# Altium project IPMC_TestBoard.PrjPcb
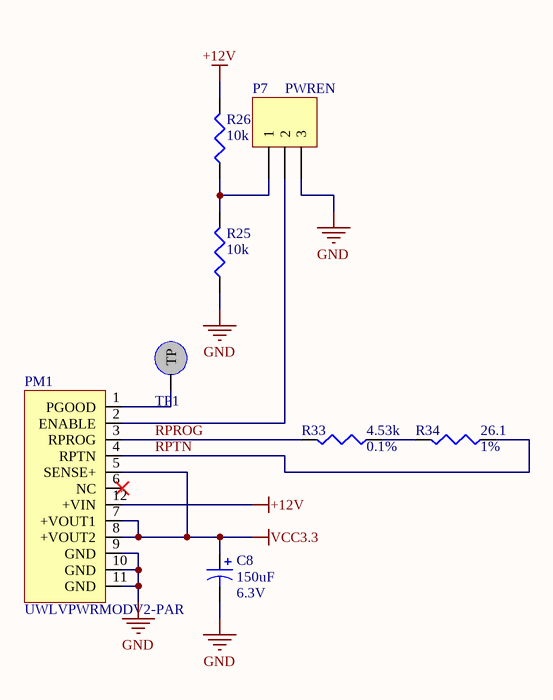
[diagram p0: IPMC_TestBoard.SchDoc]
Title: ZYNQ-IPMC Test Board; Revision: revA1; Company: Univ. Wisconsin-Madison; Author: Vicente, M.; Address2: USA; Address1: Madison, WI 53706
5 sheets, 87 parts. Net scope: global (net labels, ports and power ports of the same name join across sheets).
Board file: IPMC_TestBoard_PCB.PcbDoc
Sheets:
  IPMC_TestBoard.SchDoc
  MMC_Interface.SchDoc
  IPMC_UnderTesting.SchDoc
  IPMC_Control.SchDoc
  UART.SchDoc

## Sheet IPMC_TestBoard.SchDoc: ZYNQ-IPMC Test Board
size A3; Author: Marcelo Vicente; Organization: Univ. of Wisconsin-Madison; Address1: Madison, WI 53706; DocumentNumber: 1; Revision: revA1; SheetNumber: 1; SheetTotal: 5

### Parts
C8  value 150uF  Rating: 6.3V  [VISH-293D-7343-31_V]  (hidden comment: ?)
P7  PWREN  [HEADER1X3]
PM1  UWLVPWRMODV2-PAR  [UWLVPWRMODV2]
R25  value 10k  [R0402_IPC_H]  (hidden comment: ?)
R26  value 10k  [R0402_IPC_H]  (hidden comment: ?)
R33  value 4.53k  Tolerance: 0.1%  [R0402]  (hidden comment: ?)
R34  value 26.1  Tolerance: 1%  [R0402]  (hidden comment: ?)
TP1  TP  [TP]  (value not drawn)

### Nets
+12V: PM1.12(+VIN) R26.2
GND: C8.2 P7.3 PM1.9(GND) PM1.10(GND) PM1.11(GND) R25.1
VCC3.3: C8.1 PM1.5(SENSE+) PM1.7(+VOUT1) PM1.8(+VOUT2)
RPROG: PM1.3(RPROG) R33.2
RPTN: PM1.4(RPTN) R34.1
NetP7_1: P7.1 R25.2 R26.1
NetP7_2: P7.2 PM1.2(ENABLE)
NetPM1_1: PM1.1(PGOOD) TP1.1(TP)
NetR33_1: R33.1 R34.2

Not connected (* = marked no-connect by the designer): PM1 6(NC)*

### Notes on the sheet
- Description
- Title
- Size:
- Date:
- A3
- Number:
- Time:
- Revision:
- Sheet
- of
- File:
- Author:

### Library data of the parts
C8 = Cap Pol3: Polarized Capacitor (Surface Mount); Mfg. Part No.: A700X157M006ATE015; INVKEY: CP7343-150uF-6.3V-ESR15-20%; Mfgr: Kemet
P7 = Header 3: Header, 3-Pin; INVKEY: ?; Mfg. Part No.: ?; Mfgr: ?
PM1 = UWLVPWRMODV2-PAR: UW Low-voltage Power Module V2; Mfgr: University of Wisconsin; Note: Refurbish from oRSCs; INVKEY: ?; Mfg. Part No.: UWLVPWRMODV2
R25 R26 = Res: Resistor; Mfg. Part No.: ERJ-2GEJ103X; Tolerance: 5%; INVKEY: RS0402-10K-1/10W-5%; Mfgr: Panasonic-ECG
R33 = Res: Resistor; Mfg. Part No.: ERA-2AEB4531X; INVKEY: RS0402-4K53-1/16W-PREC; Mfgr: Panasonic-ECG
R34 = Res: Resistor; Mfg. Part No.: ERJ-2RKF26R1X; INVKEY: RS0402-26R1-1/10W-1%; Mfgr: Panasonic-ECG
TP1 = TP: Test Point; INVKEY: NA; Note: Not a part; Mfg. Part No.: NA; Mfgr: NA

## Sheet MMC_Interface.SchDoc: ZYNQ-IPMC Test Board
size A3; Author: Marcelo Vicente; Organization: Univ. of Wisconsin-Madison; Address1: Madison, WI 53706; DocumentNumber: 2; Revision: revA1; SheetNumber: 2; SheetTotal: 5
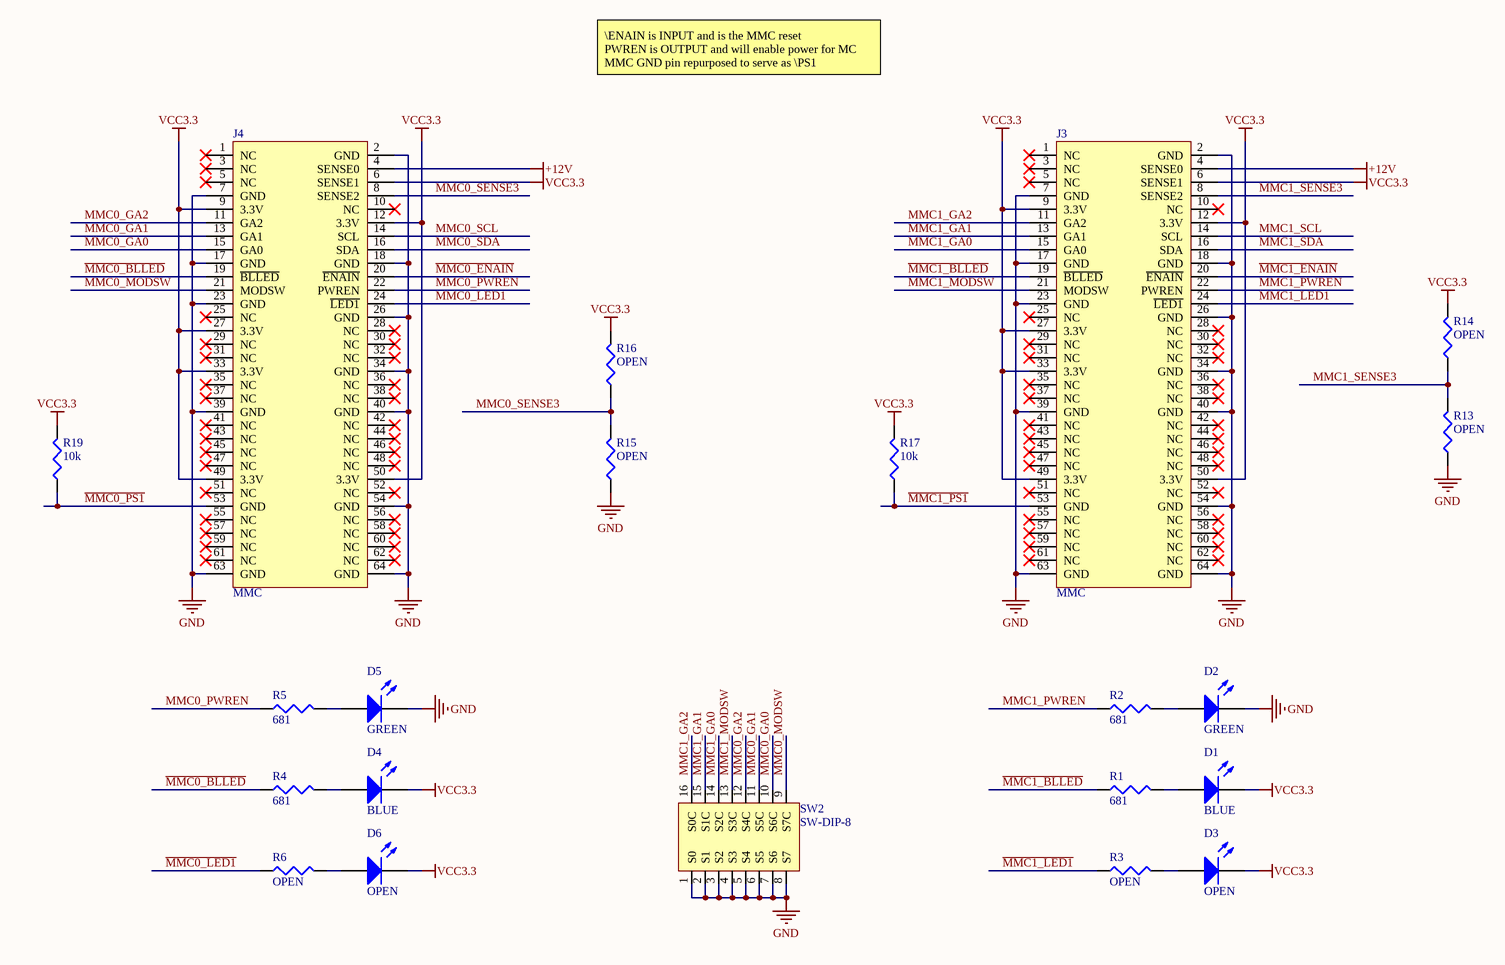
[diagram p1: MMC_Interface.SchDoc]

### Parts
D1  BLUE  [LED0603_M]
D2  GREEN  [LED0603_M]
D3  OPEN  [LED0603_M]
D4  BLUE  [LED0603_M]
D5  GREEN  [LED0603_M]
D6  OPEN  [LED0603_M]
J3  MMC  [5120527-1]
J4  MMC  [5120527-1]
R1  value 681  [R0603]  (hidden comment: ?)
R2  value 681  [R0603]  (hidden comment: ?)
R3  value OPEN  [R0402_IPC_H]  (hidden comment: ?)
R4  value 681  [R0603]  (hidden comment: ?)
R5  value 681  [R0603]  (hidden comment: ?)
R6  value OPEN  [R0402_IPC_H]  (hidden comment: ?)
R13  value OPEN  [R0402_IPC_H]  (hidden comment: ?)
R14  value OPEN  [R0402_IPC_H]  (hidden comment: ?)
R15  value OPEN  [R0402_IPC_H]  (hidden comment: ?)
R16  value OPEN  [R0402_IPC_H]  (hidden comment: ?)
R17  value 10k  [R0402_IPC_H]  (hidden comment: ?)
R19  value 10k  [R0402_IPC_H]  (hidden comment: ?)
SW2  SW-DIP-8  [TDA08H0]

### Nets
+12V: J3.4(SENSE0) J4.4(SENSE0)
GND: D2.2(K) D5.2(K) J3.2(GND) J3.7(GND) J3.17(GND) J3.18(GND) J3.23(GND) J3.26(GND) J3.34(GND) J3.39(GND) J3.40(GND) J3.54(GND) J3.63(GND) J3.64(GND) J4.2(GND) J4.7(GND) J4.17(GND) J4.18(GND) J4.23(GND) J4.26(GND) J4.34(GND) J4.39(GND) J4.40(GND) J4.54(GND) J4.63(GND) J4.64(GND) R13.1 R15.1 SW2.1(S0) SW2.2(S1) SW2.3(S2) SW2.4(S3) SW2.5(S4) SW2.6(S5) SW2.7(S6) SW2.8(S7)
VCC3.3: D1.2(K) D3.2(K) D4.2(K) D6.2(K) J3.6(SENSE1) J3.9(3.3V) J3.12(3.3V) J3.27(3.3V) J3.33(3.3V) J3.49(3.3V) J3.50(3.3V) J4.6(SENSE1) J4.9(3.3V) J4.12(3.3V) J4.27(3.3V) J4.33(3.3V) J4.49(3.3V) J4.50(3.3V) R14.2 R16.2 R17.2 R19.2
~{MMC0_BLLED}: J4.19(~{BLLED}) R4.1
~{MMC0_ENAIN}: J4.20(~{ENAIN})
~{MMC0_LED1}: J4.24(~{LED1}) R6.1
~{MMC0_PS1}: J4.53(GND) R19.1
~{MMC1_BLLED}: J3.19(~{BLLED}) R1.1
~{MMC1_ENAIN}: J3.20(~{ENAIN})
~{MMC1_LED1}: J3.24(~{LED1}) R3.1
~{MMC1_PS1}: J3.53(GND) R17.1
MMC0_GA0: J4.15(GA0) SW2.10(S6C)
MMC0_GA1: J4.13(GA1) SW2.11(S5C)
MMC0_GA2: J4.11(GA2) SW2.12(S4C)
MMC0_MODSW: J4.21(MODSW) SW2.9(S7C)
MMC0_PWREN: J4.22(PWREN) R5.1
MMC0_SCL: J4.14(SCL)
MMC0_SDA: J4.16(SDA)
MMC0_SENSE3: J4.8(SENSE2) R15.2 R16.1
MMC1_GA0: J3.15(GA0) SW2.14(S2C)
MMC1_GA1: J3.13(GA1) SW2.15(S1C)
MMC1_GA2: J3.11(GA2) SW2.16(S0C)
MMC1_MODSW: J3.21(MODSW) SW2.13(S3C)
MMC1_PWREN: J3.22(PWREN) R2.1
MMC1_SCL: J3.14(SCL)
MMC1_SDA: J3.16(SDA)
MMC1_SENSE3: J3.8(SENSE2) R13.2 R14.1
NetD1_1: D1.1(A) R1.2
NetD2_1: D2.1(A) R2.2
NetD3_1: D3.1(A) R3.2
NetD4_1: D4.1(A) R4.2
NetD5_1: D5.1(A) R5.2
NetD6_1: D6.1(A) R6.2

Not connected (* = marked no-connect by the designer): J3 1(NC)* 3(NC)* 5(NC)* 10(NC)* 25(NC)* 28(NC)* 29(NC)* 30(NC)* 31(NC)* 32(NC)* 35(NC)* 36(NC)* 37(NC)* 38(NC)* 41(NC)* 42(NC)* 43(NC)* 44(NC)* 45(NC)* 46(NC)* 47(NC)* 48(NC)* 51(NC)* 52(NC)* 55(NC)* 56(NC)* 57(NC)* 58(NC)* 59(NC)* 60(NC)* 61(NC)* 62(NC)*; J4 1(NC)* 3(NC)* 5(NC)* 10(NC)* 25(NC)* 28(NC)* 29(NC)* 30(NC)* 31(NC)* 32(NC)* 35(NC)* 36(NC)* 37(NC)* 38(NC)* 41(NC)* 42(NC)* 43(NC)* 44(NC)* 45(NC)* 46(NC)* 47(NC)* 48(NC)* 51(NC)* 52(NC)* 55(NC)* 56(NC)* 57(NC)* 58(NC)* 59(NC)* 60(NC)* 61(NC)* 62(NC)*

### Notes on the sheet
- \ENAIN is INPUT and is the MMC reset
  PWREN is OUTPUT and will enable power for MC
  MMC GND pin repurposed to serve as \PS1
- Description
- Title
- Size:
- Date:
- A3
- Number:
- Time:
- Revision:
- Sheet
- of
- File:
- Author:

### Library data of the parts
D1 D4 = LED: Light Emitting Diode; Mfg. Part No.: LTST-S270TBKT; INVKEY: LED-BL-RA-0603; Mfgr: Lite-On; Value: BLUE
D2 D5 = LED: Light Emitting Diode; Mfg. Part No.: LTST-S270KGKT; INVKEY: LED-GRN-RA-UB-0603; Mfgr: Lite-On; Value: GREEN
D3 D6 = LED: Light Emitting Diode; Mfg. Part No.: NA; Note: Do not assemble; Value: OPEN; INVKEY: ?; Mfgr: NA
J3 J4 = MMC: TE 5120527-1; INVKEY: CO-PMC64-120527-1; Mfgr: TE Connectivity; Mfg. Part No.: 5120527-1
R1 R2 R4 R5 = Res: Resistor; Mfg. Part No.: RC0603FR-07681RL; Tolerance: 1%; INVKEY: RS0603-681R-1/10W-1%; Mfgr: Yageo
R3 R6 R13-R16 = Res: Resistor; Mfg. Part No.: NA; Tolerance: 1%; INVKEY: RS0402-OPEN-1/10W; Note: Do not assemble; Mfgr: NA
R17 R19 = Res: as R25 on sheet IPMC_TestBoard
SW2 = SW-DIP-8: C&K TDA08H0SB1R; Mfg. Part No.: TDA08HOSB1; INVKEY: SW-DIP-8X-SMD; Mfgr: C&K

## Sheet IPMC_UnderTesting.SchDoc: ZYNQ-IPMC Test Board
size A3; Author: Marcelo Vicente; Organization: Univ. of Wisconsin-Madison; Address1: Madison, WI 53706; DocumentNumber: 3; Revision: revA1; SheetNumber: 3; SheetTotal: 5
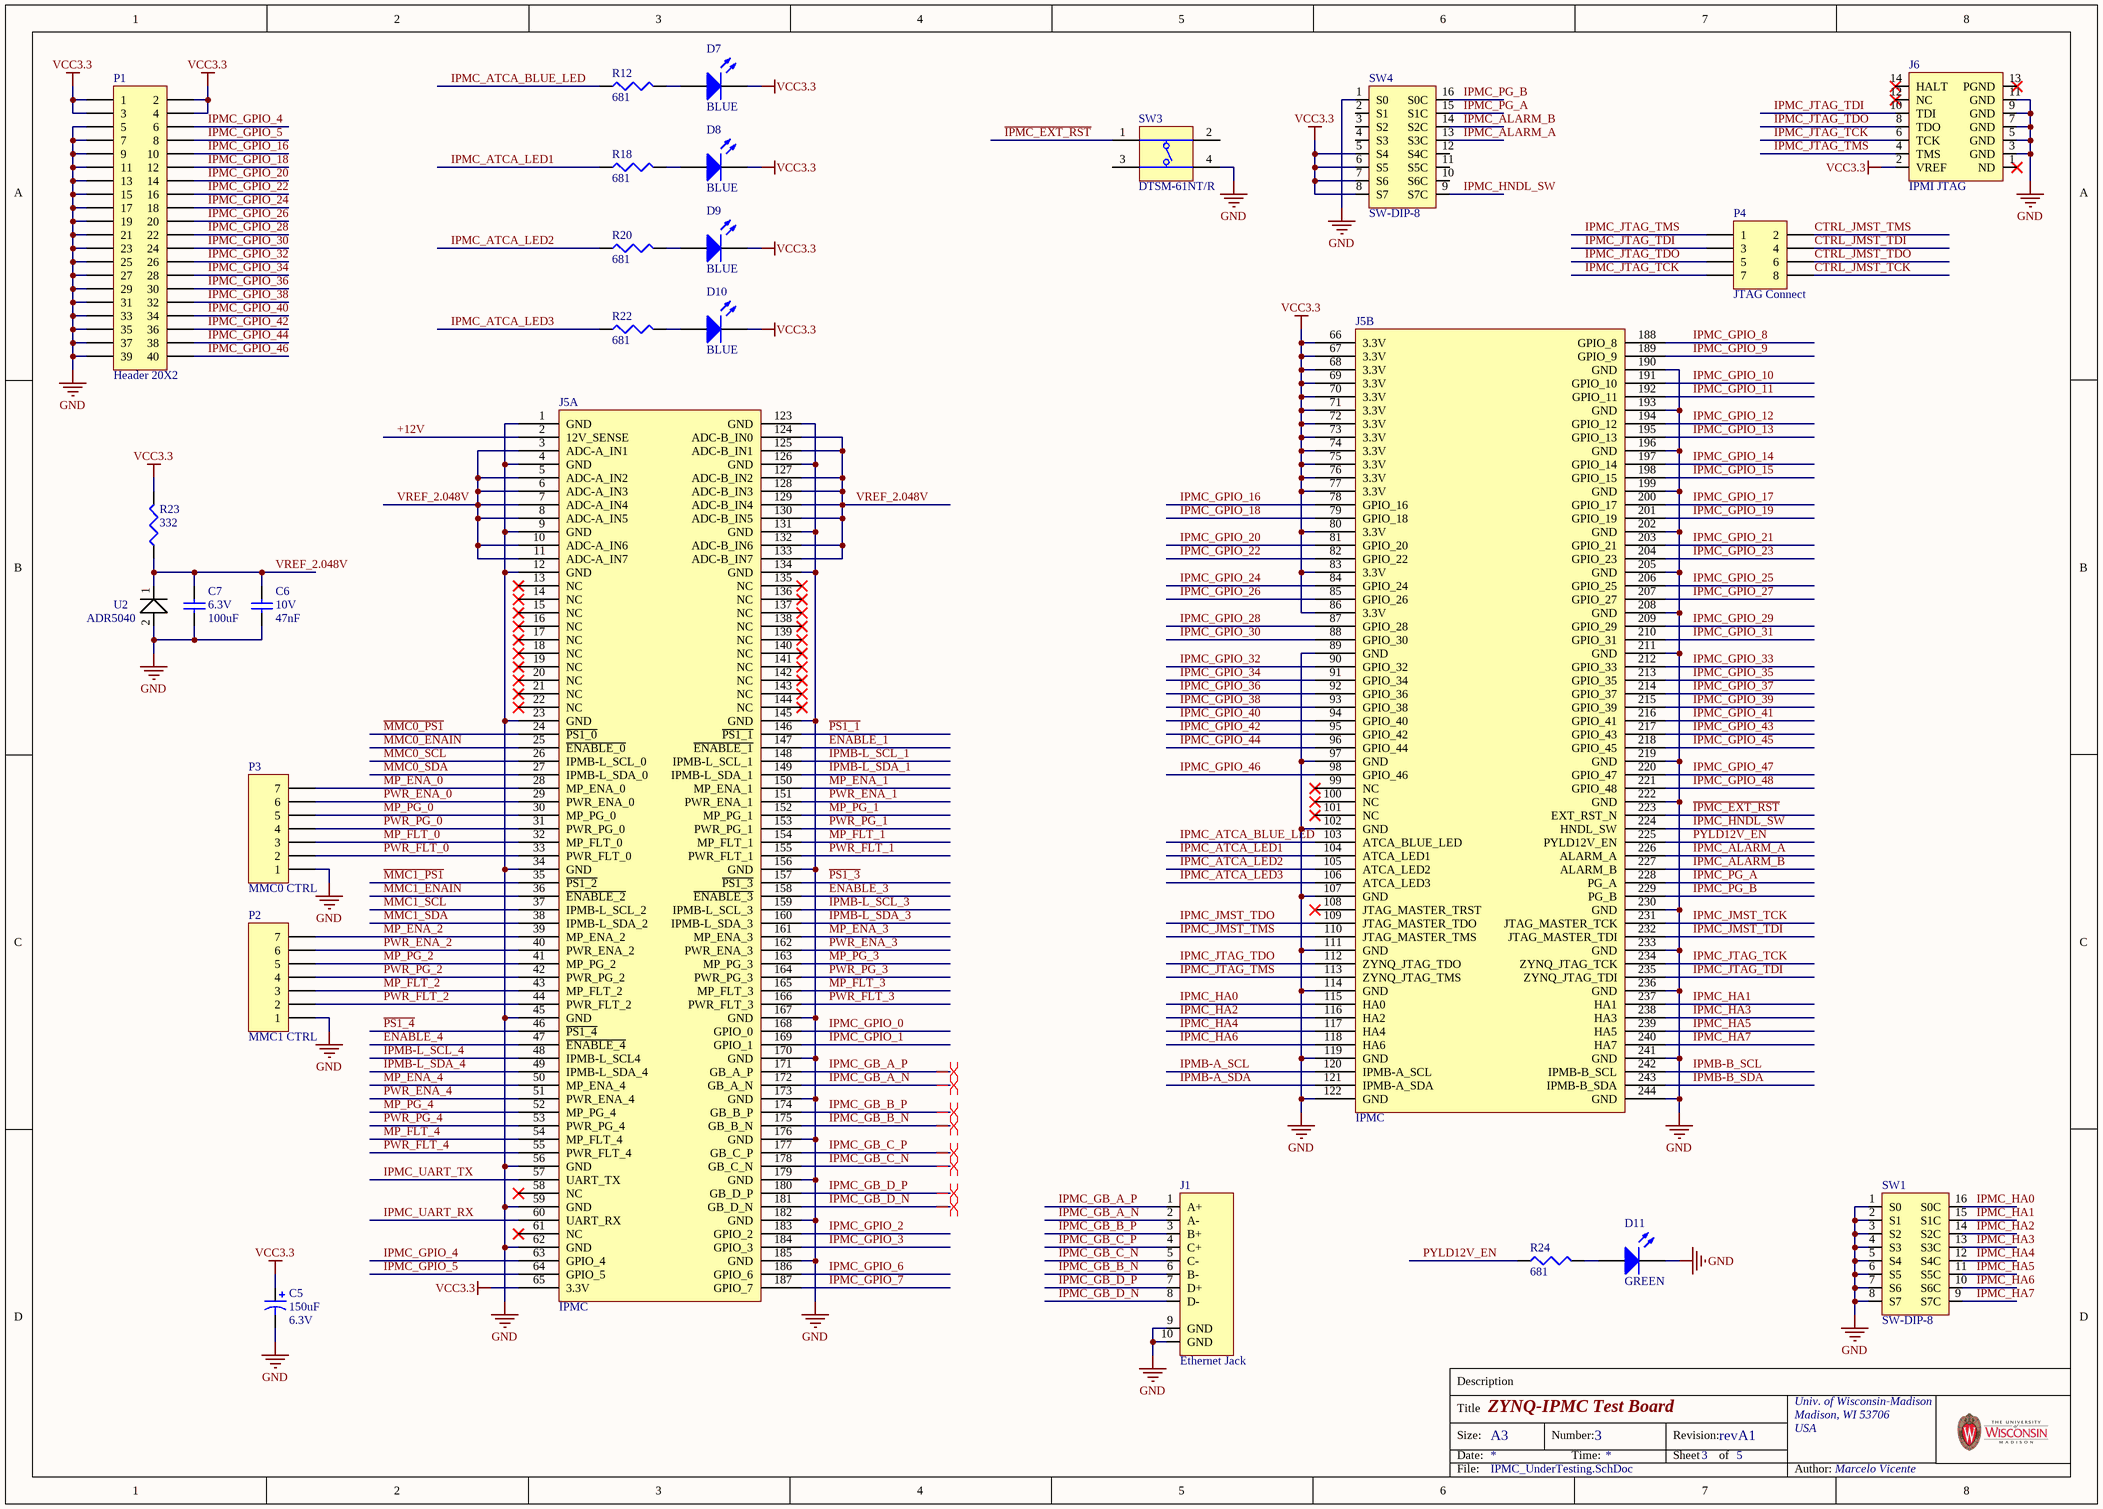
[diagram p2: IPMC_UnderTesting.SchDoc]

### Parts
C5  value 150uF  Rating: 6.3V  [VISH-293D-7343-31_V]  (hidden comment: ?)
C6  value 47nF  Rating: 10V  [C0402_IPC_H]  (hidden comment: ?)
C7  value 100uF  Rating: 6.3V  [C1210_IPC_H]  (hidden comment: ?)
D7  BLUE  [LED0603_M]
D8  BLUE  [LED0603_M]
D9  BLUE  [LED0603_M]
D10  BLUE  [LED0603_M]
D11  GREEN  [LED0603_M]
J1  Ethernet Jack  [43202-8916]
J5  IPMC  [87782-3007]  (parts A,B of 2)
J6  IPMI JTAG  [87832-1420]
P1  Header 20X2  [HEADER2X20]
P2  MMC1 CTRL  [HEADER1X7]
P3  MMC0 CTRL  [HEADER1X7]
P4  JTAG Connect  [HEADER2X4]
R12  value 681  [R0603]  (hidden comment: ?)
R18  value 681  [R0603]  (hidden comment: ?)
R20  value 681  [R0603]  (hidden comment: ?)
R22  value 681  [R0603]  (hidden comment: ?)
R23  value 332  [R0402_IPC_H]  (hidden comment: ?)
R24  value 681  [R0603]  (hidden comment: ?)
SW1  SW-DIP-8  [TDA08H0]
SW3  DTSM-61NT/R  [DIPT-DTSM-6_V]
SW4  SW-DIP-8  [TDA08H0]
U2  ADR5040  [SOT23-H]

### Nets
+12V: J5.2(12V_SENSE)
GND: C5.2 C6.1 C7.1 D11.2(K) J1.9(GND) J1.10(GND) J5.1(GND) J5.4(GND) J5.9(GND) J5.12(GND) J5.23(GND) J5.34(GND) J5.45(GND) J5.56(GND) J5.59(GND) J5.62(GND) J5.89(GND) J5.97(GND) J5.102(GND) J5.107(GND) J5.111(GND) J5.114(GND) J5.119(GND) J5.122(GND) J5.123(GND) J5.126(GND) J5.131(GND) J5.134(GND) J5.145(GND) J5.156(GND) J5.167(GND) J5.170(GND) J5.173(GND) J5.176(GND) J5.179(GND) J5.182(GND) J5.185(GND) J5.190(GND) J5.193(GND) J5.196(GND) J5.199(GND) J5.202(GND) J5.205(GND) J5.208(GND) J5.211(GND) J5.219(GND) J5.222(GND) J5.230(GND) J5.233(GND) J5.236(GND) J5.241(GND) J5.244(GND) J6.3(GND) J6.5(GND) J6.7(GND) J6.9(GND) J6.11(GND) P1.5 P1.7 P1.9 P1.11 P1.13 P1.15 P1.17 P1.19 P1.21 P1.23 P1.25 P1.27 P1.29 P1.31 P1.33 P1.35 P1.37 P1.39 P2.1 P3.1 SW1.1(S0) SW1.2(S1) SW1.3(S2) SW1.4(S3) SW1.5(S4) SW1.6(S5) SW1.7(S6) SW1.8(S7) SW3.4(T3) SW4.1(S0) U2.2(V+)
VCC3.3: C5.1 D7.2(K) D8.2(K) D9.2(K) D10.2(K) J5.65(3.3V) J5.66(3.3V) J5.67(3.3V) J5.68(3.3V) J5.69(3.3V) J5.70(3.3V) J5.71(3.3V) J5.72(3.3V) J5.73(3.3V) J5.74(3.3V) J5.75(3.3V) J5.76(3.3V) J5.77(3.3V) J5.80(3.3V) J5.83(3.3V) J5.86(3.3V) J6.2(VREF) P1.1 P1.2 P1.3 P1.4 R23.2 SW4.5(S4) SW4.6(S5) SW4.7(S6) SW4.8(S7)
~{ENABLE_1}: J5.147(~{ENABLE_1})
~{ENABLE_3}: J5.158(~{ENABLE_3})
~{ENABLE_4}: J5.47(~{ENABLE_4})
~{IPMC_EXT_RST}: J5.223(EXT_RST_N) SW3.1(T1)
~{MMC0_ENAIN}: J5.25(~{ENABLE_0})
~{MMC0_PS1}: J5.24(~{PS1_0})
~{MMC1_ENAIN}: J5.36(~{ENABLE_2})
~{MMC1_PS1}: J5.35(~{PS1_2})
~{PS1_1}: J5.146(~{PS1_1})
~{PS1_3}: J5.157(~{PS1_3})
~{PS1_4}: J5.46(~{PS1_4})
CTRL_JMST_TCK: P4.8
CTRL_JMST_TDI: P4.4
CTRL_JMST_TDO: P4.6
CTRL_JMST_TMS: P4.2
IPMB-A_SCL: J5.120(IPMB-A_SCL)
IPMB-A_SDA: J5.121(IPMB-A_SDA)
IPMB-B_SCL: J5.242(IPMB-B_SCL)
IPMB-B_SDA: J5.243(IPMB-B_SDA)
IPMB-L_SCL_1: J5.148(IPMB-L_SCL_1)
IPMB-L_SCL_3: J5.159(IPMB-L_SCL_3)
IPMB-L_SCL_4: J5.48(IPMB-L_SCL4)
IPMB-L_SDA_1: J5.149(IPMB-L_SDA_1)
IPMB-L_SDA_3: J5.160(IPMB-L_SDA_3)
IPMB-L_SDA_4: J5.49(IPMB-L_SDA_4)
IPMC_ALARM_A: J5.226(ALARM_A) SW4.13(S3C)
IPMC_ALARM_B: J5.227(ALARM_B) SW4.14(S2C)
IPMC_ATCA_BLUE_LED: J5.103(ATCA_BLUE_LED) R12.1
IPMC_ATCA_LED1: J5.104(ATCA_LED1) R18.1
IPMC_ATCA_LED2: J5.105(ATCA_LED2) R20.1
IPMC_ATCA_LED3: J5.106(ATCA_LED3) R22.1
IPMC_GB_A_N: J1.2(A-) J5.172(GB_A_N)
IPMC_GB_A_P: J1.1(A+) J5.171(GB_A_P)
IPMC_GB_B_N: J1.6(B-) J5.175(GB_B_N)
IPMC_GB_B_P: J1.3(B+) J5.174(GB_B_P)
IPMC_GB_C_N: J1.5(C-) J5.178(GB_C_N)
IPMC_GB_C_P: J1.4(C+) J5.177(GB_C_P)
IPMC_GB_D_N: J1.8(D-) J5.181(GB_D_N)
IPMC_GB_D_P: J1.7(D+) J5.180(GB_D_P)
IPMC_GPIO_0: J5.168(GPIO_0)
IPMC_GPIO_1: J5.169(GPIO_1)
IPMC_GPIO_2: J5.183(GPIO_2)
IPMC_GPIO_3: J5.184(GPIO_3)
IPMC_GPIO_4: J5.63(GPIO_4) P1.6
IPMC_GPIO_5: J5.64(GPIO_5) P1.8
IPMC_GPIO_6: J5.186(GPIO_6)
IPMC_GPIO_7: J5.187(GPIO_7)
IPMC_GPIO_8: J5.188(GPIO_8)
IPMC_GPIO_9: J5.189(GPIO_9)
IPMC_GPIO_10: J5.191(GPIO_10)
IPMC_GPIO_11: J5.192(GPIO_11)
IPMC_GPIO_12: J5.194(GPIO_12)
IPMC_GPIO_13: J5.195(GPIO_13)
IPMC_GPIO_14: J5.197(GPIO_14)
IPMC_GPIO_15: J5.198(GPIO_15)
IPMC_GPIO_16: J5.78(GPIO_16) P1.10
IPMC_GPIO_17: J5.200(GPIO_17)
IPMC_GPIO_18: J5.79(GPIO_18) P1.12
IPMC_GPIO_19: J5.201(GPIO_19)
IPMC_GPIO_20: J5.81(GPIO_20) P1.14
IPMC_GPIO_21: J5.203(GPIO_21)
IPMC_GPIO_22: J5.82(GPIO_22) P1.16
IPMC_GPIO_23: J5.204(GPIO_23)
IPMC_GPIO_24: J5.84(GPIO_24) P1.18
IPMC_GPIO_25: J5.206(GPIO_25)
IPMC_GPIO_26: J5.85(GPIO_26) P1.20
IPMC_GPIO_27: J5.207(GPIO_27)
IPMC_GPIO_28: J5.87(GPIO_28) P1.22
IPMC_GPIO_29: J5.209(GPIO_29)
IPMC_GPIO_30: J5.88(GPIO_30) P1.24
IPMC_GPIO_31: J5.210(GPIO_31)
IPMC_GPIO_32: J5.90(GPIO_32) P1.26
IPMC_GPIO_33: J5.212(GPIO_33)
IPMC_GPIO_34: J5.91(GPIO_34) P1.28
IPMC_GPIO_35: J5.213(GPIO_35)
IPMC_GPIO_36: J5.92(GPIO_36) P1.30
IPMC_GPIO_37: J5.214(GPIO_37)
IPMC_GPIO_38: J5.93(GPIO_38) P1.32
IPMC_GPIO_39: J5.215(GPIO_39)
IPMC_GPIO_40: J5.94(GPIO_40) P1.34
IPMC_GPIO_41: J5.216(GPIO_41)
IPMC_GPIO_42: J5.95(GPIO_42) P1.36
IPMC_GPIO_43: J5.217(GPIO_43)
IPMC_GPIO_44: J5.96(GPIO_44) P1.38
IPMC_GPIO_45: J5.218(GPIO_45)
IPMC_GPIO_46: J5.98(GPIO_46) P1.40
IPMC_GPIO_47: J5.220(GPIO_47)
IPMC_GPIO_48: J5.221(GPIO_48)
IPMC_HA0: J5.115(HA0) SW1.16(S0C)
IPMC_HA1: J5.237(HA1) SW1.15(S1C)
IPMC_HA2: J5.116(HA2) SW1.14(S2C)
IPMC_HA3: J5.238(HA3) SW1.13(S3C)
IPMC_HA4: J5.117(HA4) SW1.12(S4C)
IPMC_HA5: J5.239(HA5) SW1.11(S5C)
IPMC_HA6: J5.118(HA6) SW1.10(S6C)
IPMC_HA7: J5.240(HA7) SW1.9(S7C)
IPMC_HNDL_SW: J5.224(HNDL_SW) SW4.9(S7C)
IPMC_JMST_TCK: J5.231(JTAG_MASTER_TCK)
IPMC_JMST_TDI: J5.232(JTAG_MASTER_TDI)
IPMC_JMST_TDO: J5.109(JTAG_MASTER_TDO)
IPMC_JMST_TMS: J5.110(JTAG_MASTER_TMS)
IPMC_JTAG_TCK: J5.234(ZYNQ_JTAG_TCK) J6.6(TCK) P4.7
IPMC_JTAG_TDI: J5.235(ZYNQ_JTAG_TDI) J6.10(TDI) P4.3
IPMC_JTAG_TDO: J5.112(ZYNQ_JTAG_TDO) J6.8(TDO) P4.5
IPMC_JTAG_TMS: J5.113(ZYNQ_JTAG_TMS) J6.4(TMS) P4.1
IPMC_PG_A: J5.228(PG_A) SW4.15(S1C)
IPMC_PG_B: J5.229(PG_B) SW4.16(S0C)
IPMC_UART_RX: J5.60(UART_RX)
IPMC_UART_TX: J5.57(UART_TX)
MMC0_SCL: J5.26(IPMB-L_SCL_0)
MMC0_SDA: J5.27(IPMB-L_SDA_0)
MMC1_SCL: J5.37(IPMB-L_SCL_2)
MMC1_SDA: J5.38(IPMB-L_SDA_2)
MP_ENA_0: J5.28(MP_ENA_0) P3.7
MP_ENA_1: J5.150(MP_ENA_1)
MP_ENA_2: J5.39(MP_ENA_2) P2.7
MP_ENA_3: J5.161(MP_ENA_3)
MP_ENA_4: J5.50(MP_ENA_4)
MP_FLT_0: J5.32(MP_FLT_0) P3.3
MP_FLT_1: J5.154(MP_FLT_1)
MP_FLT_2: J5.43(MP_FLT_2) P2.3
MP_FLT_3: J5.165(MP_FLT_3)
MP_FLT_4: J5.54(MP_FLT_4)
MP_PG_0: J5.30(MP_PG_0) P3.5
MP_PG_1: J5.152(MP_PG_1)
MP_PG_2: J5.41(MP_PG_2) P2.5
MP_PG_3: J5.163(MP_PG_3)
MP_PG_4: J5.52(MP_PG_4)
PWR_ENA_0: J5.29(PWR_ENA_0) P3.6
PWR_ENA_1: J5.151(PWR_ENA_1)
PWR_ENA_2: J5.40(PWR_ENA_2) P2.6
PWR_ENA_3: J5.162(PWR_ENA_3)
PWR_ENA_4: J5.51(PWR_ENA_4)
PWR_FLT_0: J5.33(PWR_FLT_0) P3.2
PWR_FLT_1: J5.155(PWR_FLT_1)
PWR_FLT_2: J5.44(PWR_FLT_2) P2.2
PWR_FLT_3: J5.166(PWR_FLT_3)
PWR_FLT_4: J5.55(PWR_FLT_4)
PWR_PG_0: J5.31(PWR_PG_0) P3.4
PWR_PG_1: J5.153(PWR_PG_1)
PWR_PG_2: J5.42(PWR_PG_2) P2.4
PWR_PG_3: J5.164(PWR_PG_3)
PWR_PG_4: J5.53(PWR_PG_4)
PYLD12V_EN: J5.225(PYLD12V_EN) R24.1
VREF_2.048V: C6.2 C7.2 J5.3(ADC-A_IN1) J5.5(ADC-A_IN2) J5.6(ADC-A_IN3) J5.7(ADC-A_IN4) J5.8(ADC-A_IN5) J5.10(ADC-A_IN6) J5.11(ADC-A_IN7) J5.124(ADC-B_IN0) J5.125(ADC-B_IN1) J5.127(ADC-B_IN2) J5.128(ADC-B_IN3) J5.129(ADC-B_IN4) J5.130(ADC-B_IN5) J5.132(ADC-B_IN6) J5.133(ADC-B_IN7) R23.1 U2.1(V+)
NetD7_1: D7.1(A) R12.2
NetD8_1: D8.1(A) R18.2
NetD9_1: D9.1(A) R20.2
NetD10_1: D10.1(A) R22.2
NetD11_1: D11.1(A) R24.2

Not connected (* = marked no-connect by the designer): J5 13(NC)* 14(NC)* 15(NC)* 16(NC)* 17(NC)* 18(NC)* 19(NC)* 20(NC)* 21(NC)* 22(NC)* 58(NC)* 61(NC)* 99(NC)* 100(NC)* 101(NC)* 108(JTAG_MASTER_TRST)* 135(NC)* 136(NC)* 137(NC)* 138(NC)* 139(NC)* 140(NC)* 141(NC)* 142(NC)* 143(NC)* 144(NC)*; J6 1(ND)* 12(NC)* 13(PGND)* 14(HALT)*; SW3 2(T2) 3(T3); SW4 2(S1) 3(S2) 4(S3) 10(S6C) 11(S5C) 12(S4C)

### Layout directives
differential pair: IPMC_GB_A_N, IPMC_GB_A_P, IPMC_GB_B_N, IPMC_GB_B_P, IPMC_GB_C_N, IPMC_GB_C_P, IPMC_GB_D_N, IPMC_GB_D_P

### Notes on the sheet
- Description
- Title
- Size:
- Date:
- A3
- Number:
- Time:
- Revision:
- Sheet
- of
- File:
- Author:

### Library data of the parts
C5 = Cap Pol3: as C8 on sheet IPMC_TestBoard
C6 = Cap: Capacitor; Mfg. Part No.: ECJ-0EB1A473K; INVKEY: CP0402-47NF-10V-10%; Mfgr: Panasonic-ECJ
C7 = Cap: Capacitor; Mfg. Part No.: GRM32ER60J107ME20L; INVKEY: CP1210-100UF-6.3V-20%; Mfgr: Murata
D7-D10 = LED: as D1 on sheet MMC_Interface; Value: BLUE
D11 = LED: as D2 on sheet MMC_Interface; Value: GREEN
J1 = Ethernet Jack: RJ45 Ethernet Jack; INVKEY: CO-43202-8916; Mfgr: Molex; Mfg. Part No.: 43202-8916
J5 = IPMC: Molex 87782-3007; Note: Compatible with Molex 87782-3003, 87782-3005, 87782-3007 and 87782-3009; INVKEY: ?; Mfg. Part No.: 87782-3007; Mfgr: Molex
J6 = Xilinx JTAG Header: Molex 87832-1420; INVKEY: CO-PIN-HDR-2X7SS-2MM; Mfg. Part No.: 87832-1420; Mfgr: Molex
P1 = Header 20X2: Header, 20-Pin, Dual row; Note: Do not assemble; INVKEY: ?; Mfg. Part No.: ?; Mfgr: ?
P2 P3 = Header 7: Header, 7-Pin; Note: Do not assemble; INVKEY: ?; Mfg. Part No.: ?; Mfgr: ?
P4 = Header 4X2: Header, 4-Pin, Dual row; INVKEY: ?; Mfg. Part No.: ?; Mfgr: ?
R12 R18 R20 R22 R24 = Res: as R1 on sheet MMC_Interface
R23 = Res: Resistor; Tolerance: 1%; INVKEY: ?; Mfg. Part No.: ?; Mfgr: ?
SW1 SW4 = SW-DIP-8: as SW2 on sheet MMC_Interface; Mfgr: C&K
SW3 = CMP-0306-00001-1: Switch, SPNO Push Button SMD; INVKEY: ?; Mfg. Part No.: ?; Mfgr: ?
U2 = ADR5040: Precision Micropower Shunt Mode; Mfg. Part No.: ADR5040ARTZ; INVKEY: VREF-ADR5040A-SOT23; Mfgr: Analog Devices

## Sheet IPMC_Control.SchDoc: ZYNQ-IPMC Test Board
size A3; Author: Marcelo Vicente; Organization: Univ. of Wisconsin-Madison; Address1: Madison, WI 53706; DocumentNumber: 4; Revision: revA1; SheetNumber: 4; SheetTotal: 5
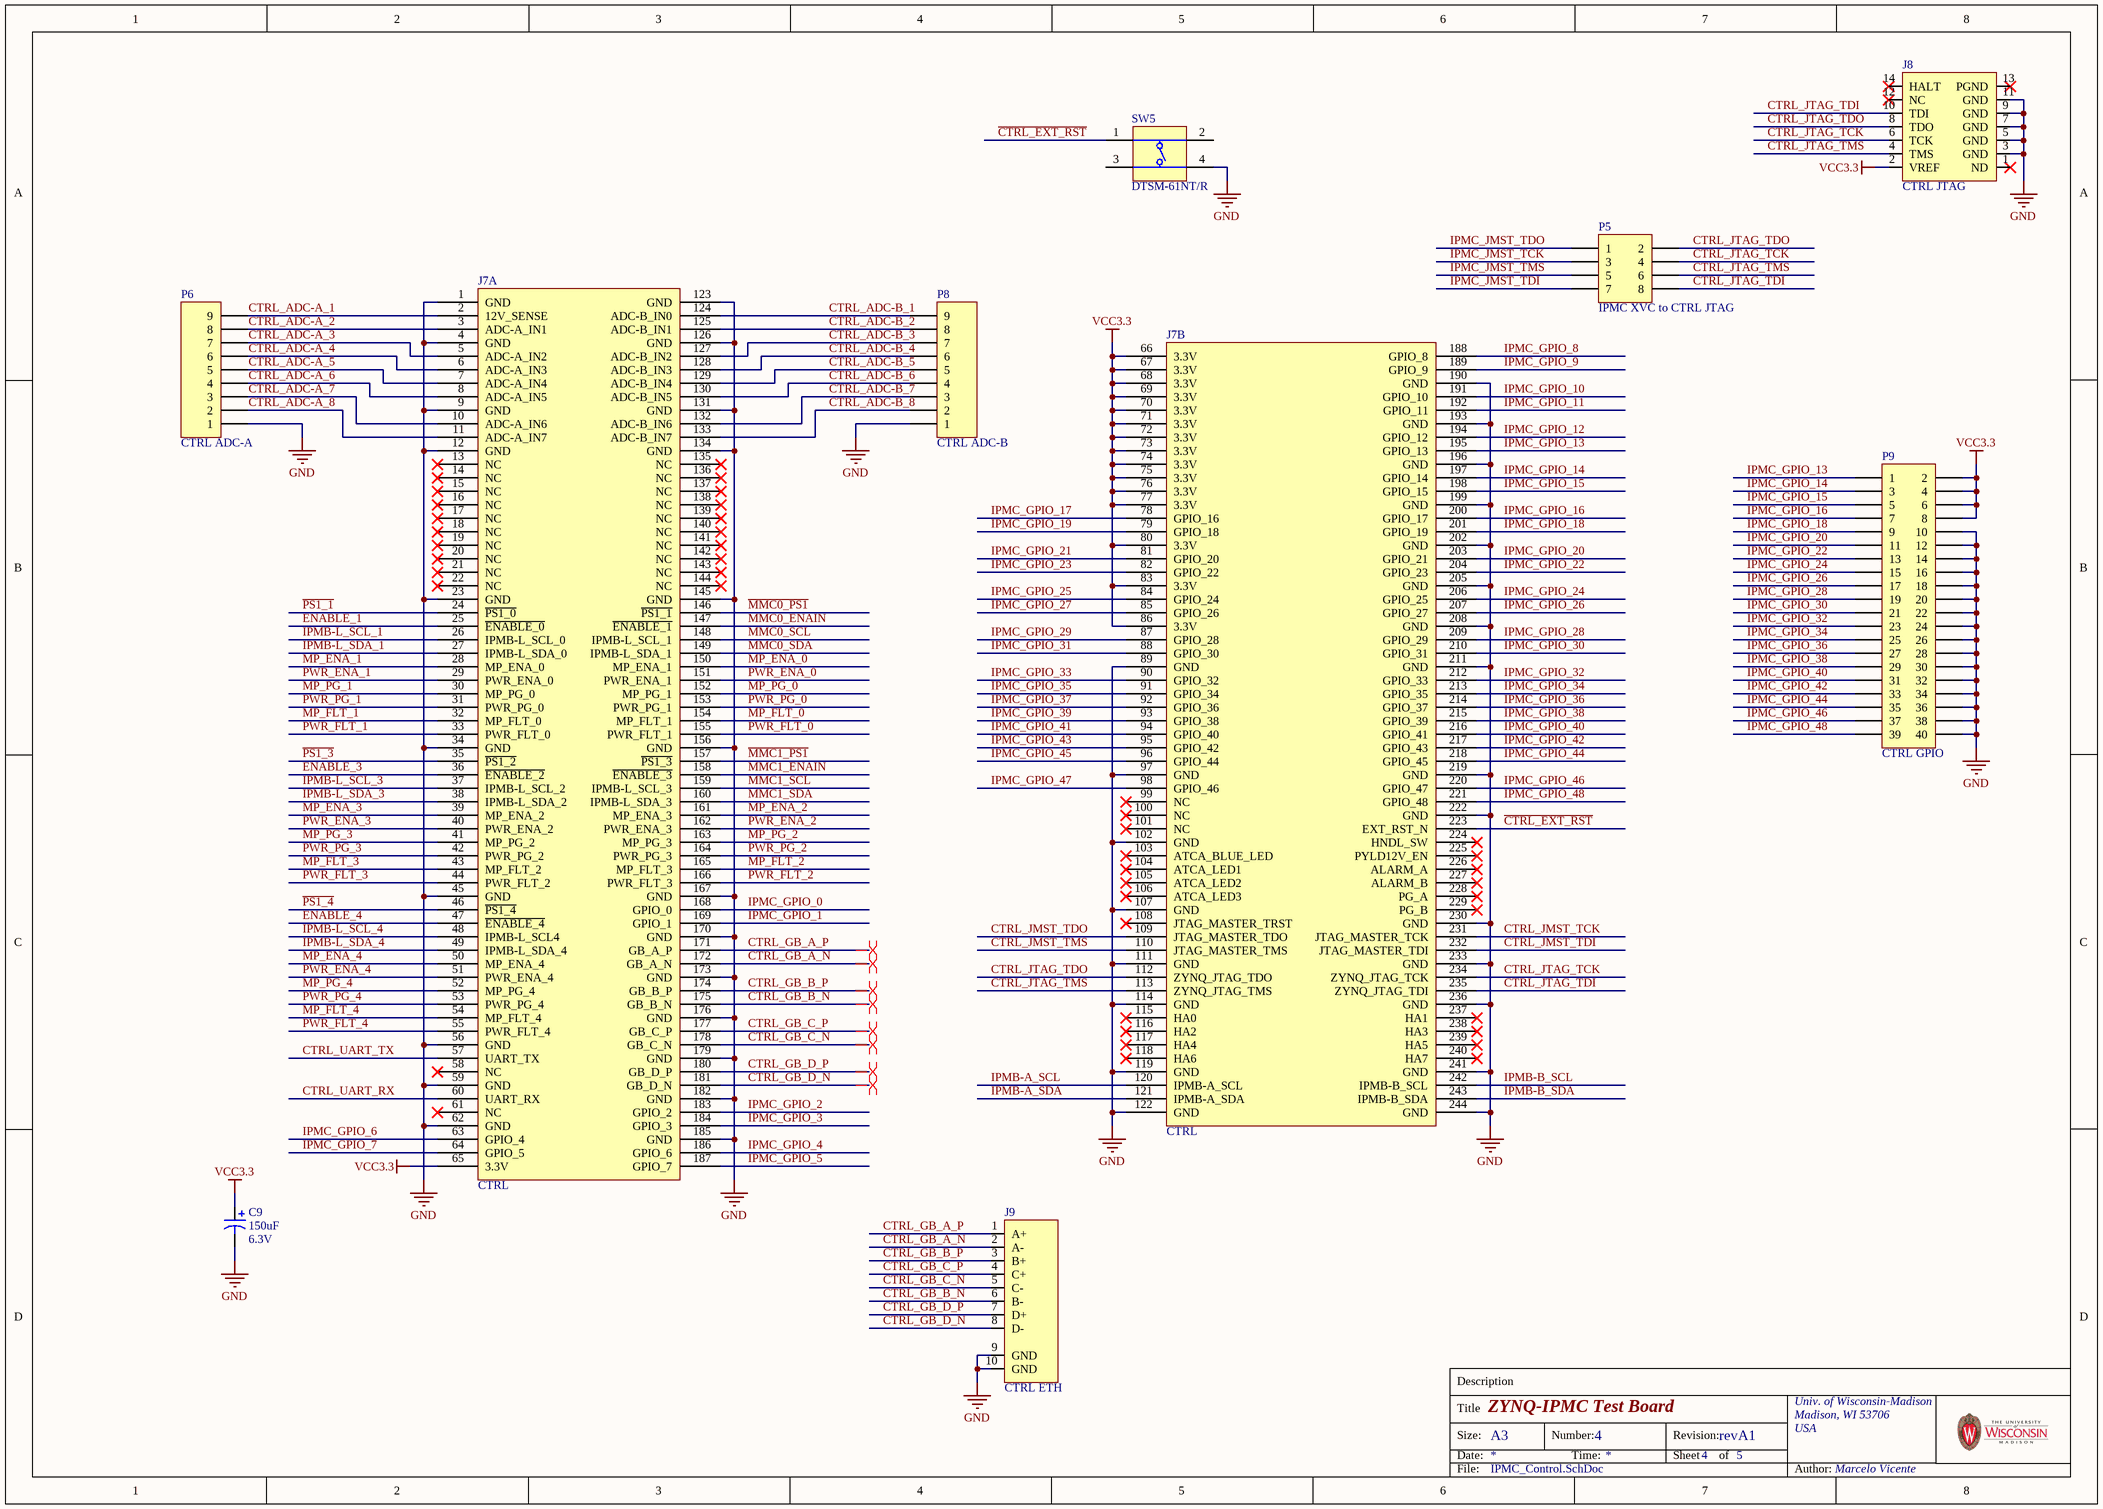
[diagram p3: IPMC_Control.SchDoc]

### Parts
C9  value 150uF  Rating: 6.3V  [VISH-293D-7343-31_V]  (hidden comment: ?)
J7  CTRL  [87782-3007]  (parts A,B of 2)
J8  CTRL JTAG  [87832-1420]
J9  CTRL ETH  [43202-8916]
P5  IPMC XVC to CTRL JTAG  [HEADER2X4]
P6  CTRL ADC-A  [HEADER1X9]
P8  CTRL ADC-B  [HEADER1X9]
P9  CTRL GPIO  [HEADER2X20]
SW5  DTSM-61NT/R  [DIPT-DTSM-6_V]

### Nets
GND: C9.2 J7.1(GND) J7.4(GND) J7.9(GND) J7.12(GND) J7.23(GND) J7.34(GND) J7.45(GND) J7.56(GND) J7.59(GND) J7.62(GND) J7.89(GND) J7.97(GND) J7.102(GND) J7.107(GND) J7.111(GND) J7.114(GND) J7.119(GND) J7.122(GND) J7.123(GND) J7.126(GND) J7.131(GND) J7.134(GND) J7.145(GND) J7.156(GND) J7.167(GND) J7.170(GND) J7.173(GND) J7.176(GND) J7.179(GND) J7.182(GND) J7.185(GND) J7.190(GND) J7.193(GND) J7.196(GND) J7.199(GND) J7.202(GND) J7.205(GND) J7.208(GND) J7.211(GND) J7.219(GND) J7.222(GND) J7.230(GND) J7.233(GND) J7.236(GND) J7.241(GND) J7.244(GND) J8.3(GND) J8.5(GND) J8.7(GND) J8.9(GND) J8.11(GND) J9.9(GND) J9.10(GND) P6.1 P8.1 P9.10 P9.12 P9.14 P9.16 P9.18 P9.20 P9.22 P9.24 P9.26 P9.28 P9.30 P9.32 P9.34 P9.36 P9.38 P9.40 SW5.4(T3)
VCC3.3: C9.1 J7.65(3.3V) J7.66(3.3V) J7.67(3.3V) J7.68(3.3V) J7.69(3.3V) J7.70(3.3V) J7.71(3.3V) J7.72(3.3V) J7.73(3.3V) J7.74(3.3V) J7.75(3.3V) J7.76(3.3V) J7.77(3.3V) J7.80(3.3V) J7.83(3.3V) J7.86(3.3V) J8.2(VREF) P9.2 P9.4 P9.6 P9.8
~{CTRL_EXT_RST}: J7.223(EXT_RST_N) SW5.1(T1)
~{ENABLE_1}: J7.25(~{ENABLE_0})
~{ENABLE_3}: J7.36(~{ENABLE_2})
~{ENABLE_4}: J7.47(~{ENABLE_4})
~{MMC0_ENAIN}: J7.147(~{ENABLE_1})
~{MMC0_PS1}: J7.146(~{PS1_1})
~{MMC1_ENAIN}: J7.158(~{ENABLE_3})
~{MMC1_PS1}: J7.157(~{PS1_3})
~{PS1_1}: J7.24(~{PS1_0})
~{PS1_3}: J7.35(~{PS1_2})
~{PS1_4}: J7.46(~{PS1_4})
CTRL_ADC-A_1: J7.2(12V_SENSE) P6.9
CTRL_ADC-A_2: J7.3(ADC-A_IN1) P6.8
CTRL_ADC-A_3: J7.5(ADC-A_IN2) P6.7
CTRL_ADC-A_4: J7.6(ADC-A_IN3) P6.6
CTRL_ADC-A_5: J7.7(ADC-A_IN4) P6.5
CTRL_ADC-A_6: J7.8(ADC-A_IN5) P6.4
CTRL_ADC-A_7: J7.10(ADC-A_IN6) P6.3
CTRL_ADC-A_8: J7.11(ADC-A_IN7) P6.2
CTRL_ADC-B_1: J7.124(ADC-B_IN0) P8.9
CTRL_ADC-B_2: J7.125(ADC-B_IN1) P8.8
CTRL_ADC-B_3: J7.127(ADC-B_IN2) P8.7
CTRL_ADC-B_4: J7.128(ADC-B_IN3) P8.6
CTRL_ADC-B_5: J7.129(ADC-B_IN4) P8.5
CTRL_ADC-B_6: J7.130(ADC-B_IN5) P8.4
CTRL_ADC-B_7: J7.132(ADC-B_IN6) P8.3
CTRL_ADC-B_8: J7.133(ADC-B_IN7) P8.2
CTRL_GB_A_N: J7.172(GB_A_N) J9.2(A-)
CTRL_GB_A_P: J7.171(GB_A_P) J9.1(A+)
CTRL_GB_B_N: J7.175(GB_B_N) J9.6(B-)
CTRL_GB_B_P: J7.174(GB_B_P) J9.3(B+)
CTRL_GB_C_N: J7.178(GB_C_N) J9.5(C-)
CTRL_GB_C_P: J7.177(GB_C_P) J9.4(C+)
CTRL_GB_D_N: J7.181(GB_D_N) J9.8(D-)
CTRL_GB_D_P: J7.180(GB_D_P) J9.7(D+)
CTRL_JMST_TCK: J7.231(JTAG_MASTER_TCK)
CTRL_JMST_TDI: J7.232(JTAG_MASTER_TDI)
CTRL_JMST_TDO: J7.109(JTAG_MASTER_TDO)
CTRL_JMST_TMS: J7.110(JTAG_MASTER_TMS)
CTRL_JTAG_TCK: J7.234(ZYNQ_JTAG_TCK) J8.6(TCK) P5.4
CTRL_JTAG_TDI: J7.235(ZYNQ_JTAG_TDI) J8.10(TDI) P5.8
CTRL_JTAG_TDO: J7.112(ZYNQ_JTAG_TDO) J8.8(TDO) P5.2
CTRL_JTAG_TMS: J7.113(ZYNQ_JTAG_TMS) J8.4(TMS) P5.6
CTRL_UART_RX: J7.60(UART_RX)
CTRL_UART_TX: J7.57(UART_TX)
IPMB-A_SCL: J7.120(IPMB-A_SCL)
IPMB-A_SDA: J7.121(IPMB-A_SDA)
IPMB-B_SCL: J7.242(IPMB-B_SCL)
IPMB-B_SDA: J7.243(IPMB-B_SDA)
IPMB-L_SCL_1: J7.26(IPMB-L_SCL_0)
IPMB-L_SCL_3: J7.37(IPMB-L_SCL_2)
IPMB-L_SCL_4: J7.48(IPMB-L_SCL4)
IPMB-L_SDA_1: J7.27(IPMB-L_SDA_0)
IPMB-L_SDA_3: J7.38(IPMB-L_SDA_2)
IPMB-L_SDA_4: J7.49(IPMB-L_SDA_4)
IPMC_GPIO_0: J7.168(GPIO_0)
IPMC_GPIO_1: J7.169(GPIO_1)
IPMC_GPIO_2: J7.183(GPIO_2)
IPMC_GPIO_3: J7.184(GPIO_3)
IPMC_GPIO_4: J7.186(GPIO_6)
IPMC_GPIO_5: J7.187(GPIO_7)
IPMC_GPIO_6: J7.63(GPIO_4)
IPMC_GPIO_7: J7.64(GPIO_5)
IPMC_GPIO_8: J7.188(GPIO_8)
IPMC_GPIO_9: J7.189(GPIO_9)
IPMC_GPIO_10: J7.191(GPIO_10)
IPMC_GPIO_11: J7.192(GPIO_11)
IPMC_GPIO_12: J7.194(GPIO_12)
IPMC_GPIO_13: J7.195(GPIO_13) P9.1
IPMC_GPIO_14: J7.197(GPIO_14) P9.3
IPMC_GPIO_15: J7.198(GPIO_15) P9.5
IPMC_GPIO_16: J7.200(GPIO_17) P9.7
IPMC_GPIO_17: J7.78(GPIO_16)
IPMC_GPIO_18: J7.201(GPIO_19) P9.9
IPMC_GPIO_19: J7.79(GPIO_18)
IPMC_GPIO_20: J7.203(GPIO_21) P9.11
IPMC_GPIO_21: J7.81(GPIO_20)
IPMC_GPIO_22: J7.204(GPIO_23) P9.13
IPMC_GPIO_23: J7.82(GPIO_22)
IPMC_GPIO_24: J7.206(GPIO_25) P9.15
IPMC_GPIO_25: J7.84(GPIO_24)
IPMC_GPIO_26: J7.207(GPIO_27) P9.17
IPMC_GPIO_27: J7.85(GPIO_26)
IPMC_GPIO_28: J7.209(GPIO_29) P9.19
IPMC_GPIO_29: J7.87(GPIO_28)
IPMC_GPIO_30: J7.210(GPIO_31) P9.21
IPMC_GPIO_31: J7.88(GPIO_30)
IPMC_GPIO_32: J7.212(GPIO_33) P9.23
IPMC_GPIO_33: J7.90(GPIO_32)
IPMC_GPIO_34: J7.213(GPIO_35) P9.25
IPMC_GPIO_35: J7.91(GPIO_34)
IPMC_GPIO_36: J7.214(GPIO_37) P9.27
IPMC_GPIO_37: J7.92(GPIO_36)
IPMC_GPIO_38: J7.215(GPIO_39) P9.29
IPMC_GPIO_39: J7.93(GPIO_38)
IPMC_GPIO_40: J7.216(GPIO_41) P9.31
IPMC_GPIO_41: J7.94(GPIO_40)
IPMC_GPIO_42: J7.217(GPIO_43) P9.33
IPMC_GPIO_43: J7.95(GPIO_42)
IPMC_GPIO_44: J7.218(GPIO_45) P9.35
IPMC_GPIO_45: J7.96(GPIO_44)
IPMC_GPIO_46: J7.220(GPIO_47) P9.37
IPMC_GPIO_47: J7.98(GPIO_46)
IPMC_GPIO_48: J7.221(GPIO_48) P9.39
IPMC_JMST_TCK: P5.3
IPMC_JMST_TDI: P5.7
IPMC_JMST_TDO: P5.1
IPMC_JMST_TMS: P5.5
MMC0_SCL: J7.148(IPMB-L_SCL_1)
MMC0_SDA: J7.149(IPMB-L_SDA_1)
MMC1_SCL: J7.159(IPMB-L_SCL_3)
MMC1_SDA: J7.160(IPMB-L_SDA_3)
MP_ENA_0: J7.150(MP_ENA_1)
MP_ENA_1: J7.28(MP_ENA_0)
MP_ENA_2: J7.161(MP_ENA_3)
MP_ENA_3: J7.39(MP_ENA_2)
MP_ENA_4: J7.50(MP_ENA_4)
MP_FLT_0: J7.154(MP_FLT_1)
MP_FLT_1: J7.32(MP_FLT_0)
MP_FLT_2: J7.165(MP_FLT_3)
MP_FLT_3: J7.43(MP_FLT_2)
MP_FLT_4: J7.54(MP_FLT_4)
MP_PG_0: J7.152(MP_PG_1)
MP_PG_1: J7.30(MP_PG_0)
MP_PG_2: J7.163(MP_PG_3)
MP_PG_3: J7.41(MP_PG_2)
MP_PG_4: J7.52(MP_PG_4)
PWR_ENA_0: J7.151(PWR_ENA_1)
PWR_ENA_1: J7.29(PWR_ENA_0)
PWR_ENA_2: J7.162(PWR_ENA_3)
PWR_ENA_3: J7.40(PWR_ENA_2)
PWR_ENA_4: J7.51(PWR_ENA_4)
PWR_FLT_0: J7.155(PWR_FLT_1)
PWR_FLT_1: J7.33(PWR_FLT_0)
PWR_FLT_2: J7.166(PWR_FLT_3)
PWR_FLT_3: J7.44(PWR_FLT_2)
PWR_FLT_4: J7.55(PWR_FLT_4)
PWR_PG_0: J7.153(PWR_PG_1)
PWR_PG_1: J7.31(PWR_PG_0)
PWR_PG_2: J7.164(PWR_PG_3)
PWR_PG_3: J7.42(PWR_PG_2)
PWR_PG_4: J7.53(PWR_PG_4)

Not connected (* = marked no-connect by the designer): J7 13(NC)* 14(NC)* 15(NC)* 16(NC)* 17(NC)* 18(NC)* 19(NC)* 20(NC)* 21(NC)* 22(NC)* 58(NC)* 61(NC)* 99(NC)* 100(NC)* 101(NC)* 103(ATCA_BLUE_LED)* 104(ATCA_LED1)* 105(ATCA_LED2)* 106(ATCA_LED3)* 108(JTAG_MASTER_TRST)* 115(HA0)* 116(HA2)* 117(HA4)* 118(HA6)* 135(NC)* 136(NC)* 137(NC)* 138(NC)* 139(NC)* 140(NC)* 141(NC)* 142(NC)* 143(NC)* 144(NC)* 224(HNDL_SW)* 225(PYLD12V_EN)* 226(ALARM_A)* 227(ALARM_B)* 228(PG_A)* 229(PG_B)* 237(HA1)* 238(HA3)* 239(HA5)* 240(HA7)*; J8 1(ND)* 12(NC)* 13(PGND)* 14(HALT)*; SW5 2(T2) 3(T3)

### Layout directives
differential pair: CTRL_GB_A_N, CTRL_GB_A_P, CTRL_GB_B_N, CTRL_GB_B_P, CTRL_GB_C_N, CTRL_GB_C_P, CTRL_GB_D_N, CTRL_GB_D_P

### Notes on the sheet
- Description
- Title
- Size:
- Date:
- A3
- Number:
- Time:
- Revision:
- Sheet
- of
- File:
- Author:

### Library data of the parts
C9 = Cap Pol3: as C8 on sheet IPMC_TestBoard
J7 = IPMC: as J5 on sheet IPMC_UnderTesting; INVKEY: ?; Mfg. Part No.: 87782-3007; Mfgr: Molex
J8 = Xilinx JTAG Header: as J6 on sheet IPMC_UnderTesting; Mfg. Part No.: 87832-1420; Mfgr: Molex
J9 = Ethernet Jack: as J1 on sheet IPMC_UnderTesting; Mfg. Part No.: 43202-8916
P5 = Header 4X2: Header, 4-Pin, Dual row; INVKEY: ?; Mfg. Part No.: ?; Mfgr: ?
P6 P8 = Header 9: Header, 9-Pin; Note: Do not assemble; INVKEY: ?; Mfg. Part No.: ?; Mfgr: ?
P9 = Header 20X2: as P1 on sheet IPMC_UnderTesting; INVKEY: ?; Mfg. Part No.: ?; Mfgr: ?
SW5 = CMP-0306-00001-1: Switch, SPNO Push Button SMD; INVKEY: ?; Mfg. Part No.: ?; Mfgr: ?

## Sheet UART.SchDoc: ZYNQ-IPMC Test Board
size A3; Author: Marcelo Vicente; Organization: Univ. of Wisconsin-Madison; Address1: Madison, WI 53706; DocumentNumber: 5; Revision: revA1; SheetNumber: 5; SheetTotal: 5
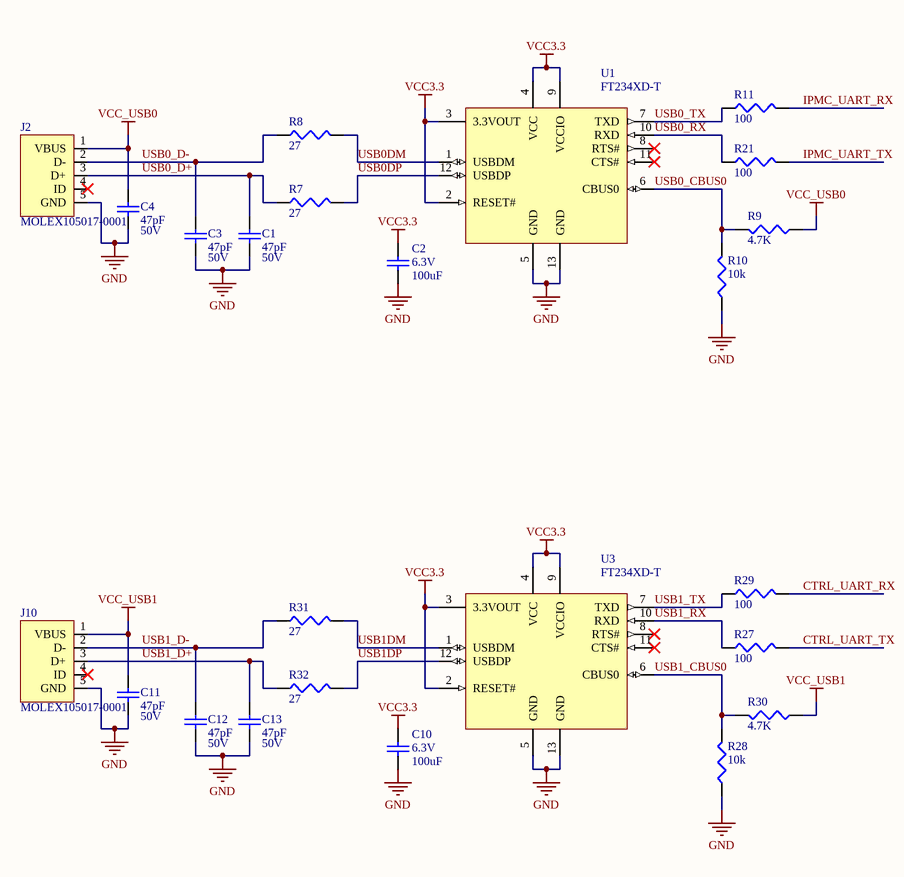
[diagram p4: UART.SchDoc]

### Parts
C1  value 47pF  Rating: 50V  [C0402]  (hidden comment: ?)
C2  value 100uF  Rating: 6.3V  [C1210_IPC_H]  (hidden comment: ?)
C3  value 47pF  Rating: 50V  [C0402]  (hidden comment: ?)
C4  value 47pF  Rating: 50V  [C0402]  (hidden comment: ?)
C10  value 100uF  Rating: 6.3V  [C1210_IPC_H]  (hidden comment: ?)
C11  value 47pF  Rating: 50V  [C0402]  (hidden comment: ?)
C12  value 47pF  Rating: 50V  [C0402]  (hidden comment: ?)
C13  value 47pF  Rating: 50V  [C0402]  (hidden comment: ?)
J2  MOLEX105017-0001  [MOLEX105017-0001]
J10  MOLEX105017-0001  [MOLEX105017-0001]
R7  value 27  [R0603]  (hidden comment: ?)
R8  value 27  [R0603]  (hidden comment: ?)
R9  value 4.7K  [R0402_IPC_H]  (hidden comment: ?)
R10  value 10k  [R0402_IPC_H]  (hidden comment: ?)
R11  value 100  [R0603]  (hidden comment: ?)
R21  value 100  [R0603]  (hidden comment: ?)
R27  value 100  [R0603]  (hidden comment: ?)
R28  value 10k  [R0402_IPC_H]  (hidden comment: ?)
R29  value 100  [R0603]  (hidden comment: ?)
R30  value 4.7K  [R0402_IPC_H]  (hidden comment: ?)
R31  value 27  [R0603]  (hidden comment: ?)
R32  value 27  [R0603]  (hidden comment: ?)
U1  FT234XD-T  [DFN-12_V]
U3  FT234XD-T  [DFN-12_V]

### Nets
GND: C1.1 C2.1 C3.1 C4.1 C10.1 C11.1 C12.1 C13.1 J2.5(GND) J10.5(GND) R10.1 R28.1 U1.5(GND) U1.13(GND) U3.5(GND) U3.13(GND)
VCC3.3: C2.2 C10.2 U1.2(RESET#) U1.3(3.3VOUT) U1.4(VCC) U1.9(VCCIO) U3.2(RESET#) U3.3(3.3VOUT) U3.4(VCC) U3.9(VCCIO)
VCC_USB0: C4.2 J2.1(VBUS) R9.1
VCC_USB1: C11.2 J10.1(VBUS) R30.1
CTRL_UART_RX: R29.2
CTRL_UART_TX: R27.2
IPMC_UART_RX: R11.2
IPMC_UART_TX: R21.2
USB0_CBUS0: R9.2 R10.2 U1.6(CBUS0)
USB0_D+: C1.2 J2.3(D+) R7.1
USB0_D-: C3.2 J2.2(D-) R8.1
USB0_RX: R21.1 U1.10(RXD)
USB0_TX: R11.1 U1.7(TXD)
USB0DM: R8.2 U1.1(USBDM)
USB0DP: R7.2 U1.12(USBDP)
USB1_CBUS0: R28.2 R30.2 U3.6(CBUS0)
USB1_D+: C13.2 J10.3(D+) R32.1
USB1_D-: C12.2 J10.2(D-) R31.1
USB1_RX: R27.1 U3.10(RXD)
USB1_TX: R29.1 U3.7(TXD)
USB1DM: R31.2 U3.1(USBDM)
USB1DP: R32.2 U3.12(USBDP)

Not connected (* = marked no-connect by the designer): J2 4(ID)*; J10 4(ID)*; U1 8(RTS#)* 11(CTS#)*; U3 8(RTS#)* 11(CTS#)*

### Notes on the sheet
- Description
- Title
- Size:
- Date:
- A3
- Number:
- Time:
- Revision:
- Sheet
- of
- File:
- Author:

### Library data of the parts
C1 C3 C4 C11-C13 = Cap Semi: Capacitor (Semiconductor SIM Model); Mfg. Part No.: CC0402JRNPO9BN470; INVKEY: CP0402-47PF-50V-5%; Mfgr: Yageo
C2 C10 = Cap: as C7 on sheet IPMC_UnderTesting
J2 J10 = MOLEX105017-0001: Micro USB Bottom Mount Receptable, B Type; INVKEY: CO-USB-MICRO-SOLDERTAIL; Mfgr: Molex; Mfg. Part No.: 105017-0001
R7 R8 R31 R32 = Res3: Resistor; INVKEY: ?; Mfg. Part No.: ?; Mfgr: ?
R9 R30 = Res: Resistor; Mfg. Part No.: ERJ-2GEJ472X; Tolerance: 5%; INVKEY: RS0402-4K7-1/10W-5%; Mfgr: Panasonic-ECG
R10 R28 = Res: as R25 on sheet IPMC_TestBoard
R11 R21 R27 R29 = Res3: Resistor; Mfg. Part No.: RC0603FR-07100RL; INVKEY: RS0603-100R-1/10W-1%; Mfgr: Yageo
U1 U3 = CMP-0248-00028-1: FT234XD USB to BASIC UART IC, -40 to +85 degC, 12-Pin DFN, Pb-Free, Tray; INVKEY: ?; Mfg. Part No.: ?; Mfgr: ?

## Nets that join several sheets
+12V: IPMC_TestBoard (PM1.12 R26.2), MMC_Interface (J3.4 J4.4), IPMC_UnderTesting (J5.2)
GND: IPMC_TestBoard (6 pins), MMC_Interface (36 pins), IPMC_UnderTesting (88 pins), IPMC_Control (73 pins), UART (16 pins)
VCC3.3: IPMC_TestBoard (C8.1 PM1.5 PM1.7 PM1.8), MMC_Interface (22 pins), IPMC_UnderTesting (31 pins), IPMC_Control (22 pins), UART (10 pins)
~{ENABLE_1}: IPMC_UnderTesting (J5.147), IPMC_Control (J7.25)
~{ENABLE_3}: IPMC_UnderTesting (J5.158), IPMC_Control (J7.36)
~{ENABLE_4}: IPMC_UnderTesting (J5.47), IPMC_Control (J7.47)
~{MMC0_ENAIN}: MMC_Interface (J4.20), IPMC_UnderTesting (J5.25), IPMC_Control (J7.147)
~{MMC0_PS1}: MMC_Interface (J4.53 R19.1), IPMC_UnderTesting (J5.24), IPMC_Control (J7.146)
~{MMC1_ENAIN}: MMC_Interface (J3.20), IPMC_UnderTesting (J5.36), IPMC_Control (J7.158)
~{MMC1_PS1}: MMC_Interface (J3.53 R17.1), IPMC_UnderTesting (J5.35), IPMC_Control (J7.157)
~{PS1_1}: IPMC_UnderTesting (J5.146), IPMC_Control (J7.24)
~{PS1_3}: IPMC_UnderTesting (J5.157), IPMC_Control (J7.35)
~{PS1_4}: IPMC_UnderTesting (J5.46), IPMC_Control (J7.46)
CTRL_JMST_TCK: IPMC_UnderTesting (P4.8), IPMC_Control (J7.231)
CTRL_JMST_TDI: IPMC_UnderTesting (P4.4), IPMC_Control (J7.232)
CTRL_JMST_TDO: IPMC_UnderTesting (P4.6), IPMC_Control (J7.109)
CTRL_JMST_TMS: IPMC_UnderTesting (P4.2), IPMC_Control (J7.110)
CTRL_UART_RX: IPMC_Control (J7.60), UART (R29.2)
CTRL_UART_TX: IPMC_Control (J7.57), UART (R27.2)
IPMB-A_SCL: IPMC_UnderTesting (J5.120), IPMC_Control (J7.120)
IPMB-A_SDA: IPMC_UnderTesting (J5.121), IPMC_Control (J7.121)
IPMB-B_SCL: IPMC_UnderTesting (J5.242), IPMC_Control (J7.242)
IPMB-B_SDA: IPMC_UnderTesting (J5.243), IPMC_Control (J7.243)
IPMB-L_SCL_1: IPMC_UnderTesting (J5.148), IPMC_Control (J7.26)
IPMB-L_SCL_3: IPMC_UnderTesting (J5.159), IPMC_Control (J7.37)
IPMB-L_SCL_4: IPMC_UnderTesting (J5.48), IPMC_Control (J7.48)
IPMB-L_SDA_1: IPMC_UnderTesting (J5.149), IPMC_Control (J7.27)
IPMB-L_SDA_3: IPMC_UnderTesting (J5.160), IPMC_Control (J7.38)
IPMB-L_SDA_4: IPMC_UnderTesting (J5.49), IPMC_Control (J7.49)
IPMC_GPIO_0: IPMC_UnderTesting (J5.168), IPMC_Control (J7.168)
IPMC_GPIO_1: IPMC_UnderTesting (J5.169), IPMC_Control (J7.169)
IPMC_GPIO_2: IPMC_UnderTesting (J5.183), IPMC_Control (J7.183)
IPMC_GPIO_3: IPMC_UnderTesting (J5.184), IPMC_Control (J7.184)
IPMC_GPIO_4: IPMC_UnderTesting (J5.63 P1.6), IPMC_Control (J7.186)
IPMC_GPIO_5: IPMC_UnderTesting (J5.64 P1.8), IPMC_Control (J7.187)
IPMC_GPIO_6: IPMC_UnderTesting (J5.186), IPMC_Control (J7.63)
IPMC_GPIO_7: IPMC_UnderTesting (J5.187), IPMC_Control (J7.64)
IPMC_GPIO_8: IPMC_UnderTesting (J5.188), IPMC_Control (J7.188)
IPMC_GPIO_9: IPMC_UnderTesting (J5.189), IPMC_Control (J7.189)
IPMC_GPIO_10: IPMC_UnderTesting (J5.191), IPMC_Control (J7.191)
IPMC_GPIO_11: IPMC_UnderTesting (J5.192), IPMC_Control (J7.192)
IPMC_GPIO_12: IPMC_UnderTesting (J5.194), IPMC_Control (J7.194)
IPMC_GPIO_13: IPMC_UnderTesting (J5.195), IPMC_Control (J7.195 P9.1)
IPMC_GPIO_14: IPMC_UnderTesting (J5.197), IPMC_Control (J7.197 P9.3)
IPMC_GPIO_15: IPMC_UnderTesting (J5.198), IPMC_Control (J7.198 P9.5)
IPMC_GPIO_16: IPMC_UnderTesting (J5.78 P1.10), IPMC_Control (J7.200 P9.7)
IPMC_GPIO_17: IPMC_UnderTesting (J5.200), IPMC_Control (J7.78)
IPMC_GPIO_18: IPMC_UnderTesting (J5.79 P1.12), IPMC_Control (J7.201 P9.9)
IPMC_GPIO_19: IPMC_UnderTesting (J5.201), IPMC_Control (J7.79)
IPMC_GPIO_20: IPMC_UnderTesting (J5.81 P1.14), IPMC_Control (J7.203 P9.11)
IPMC_GPIO_21: IPMC_UnderTesting (J5.203), IPMC_Control (J7.81)
IPMC_GPIO_22: IPMC_UnderTesting (J5.82 P1.16), IPMC_Control (J7.204 P9.13)
IPMC_GPIO_23: IPMC_UnderTesting (J5.204), IPMC_Control (J7.82)
IPMC_GPIO_24: IPMC_UnderTesting (J5.84 P1.18), IPMC_Control (J7.206 P9.15)
IPMC_GPIO_25: IPMC_UnderTesting (J5.206), IPMC_Control (J7.84)
IPMC_GPIO_26: IPMC_UnderTesting (J5.85 P1.20), IPMC_Control (J7.207 P9.17)
IPMC_GPIO_27: IPMC_UnderTesting (J5.207), IPMC_Control (J7.85)
IPMC_GPIO_28: IPMC_UnderTesting (J5.87 P1.22), IPMC_Control (J7.209 P9.19)
IPMC_GPIO_29: IPMC_UnderTesting (J5.209), IPMC_Control (J7.87)
IPMC_GPIO_30: IPMC_UnderTesting (J5.88 P1.24), IPMC_Control (J7.210 P9.21)
IPMC_GPIO_31: IPMC_UnderTesting (J5.210), IPMC_Control (J7.88)
IPMC_GPIO_32: IPMC_UnderTesting (J5.90 P1.26), IPMC_Control (J7.212 P9.23)
IPMC_GPIO_33: IPMC_UnderTesting (J5.212), IPMC_Control (J7.90)
IPMC_GPIO_34: IPMC_UnderTesting (J5.91 P1.28), IPMC_Control (J7.213 P9.25)
IPMC_GPIO_35: IPMC_UnderTesting (J5.213), IPMC_Control (J7.91)
IPMC_GPIO_36: IPMC_UnderTesting (J5.92 P1.30), IPMC_Control (J7.214 P9.27)
IPMC_GPIO_37: IPMC_UnderTesting (J5.214), IPMC_Control (J7.92)
IPMC_GPIO_38: IPMC_UnderTesting (J5.93 P1.32), IPMC_Control (J7.215 P9.29)
IPMC_GPIO_39: IPMC_UnderTesting (J5.215), IPMC_Control (J7.93)
IPMC_GPIO_40: IPMC_UnderTesting (J5.94 P1.34), IPMC_Control (J7.216 P9.31)
IPMC_GPIO_41: IPMC_UnderTesting (J5.216), IPMC_Control (J7.94)
IPMC_GPIO_42: IPMC_UnderTesting (J5.95 P1.36), IPMC_Control (J7.217 P9.33)
IPMC_GPIO_43: IPMC_UnderTesting (J5.217), IPMC_Control (J7.95)
IPMC_GPIO_44: IPMC_UnderTesting (J5.96 P1.38), IPMC_Control (J7.218 P9.35)
IPMC_GPIO_45: IPMC_UnderTesting (J5.218), IPMC_Control (J7.96)
IPMC_GPIO_46: IPMC_UnderTesting (J5.98 P1.40), IPMC_Control (J7.220 P9.37)
IPMC_GPIO_47: IPMC_UnderTesting (J5.220), IPMC_Control (J7.98)
IPMC_GPIO_48: IPMC_UnderTesting (J5.221), IPMC_Control (J7.221 P9.39)
IPMC_JMST_TCK: IPMC_UnderTesting (J5.231), IPMC_Control (P5.3)
IPMC_JMST_TDI: IPMC_UnderTesting (J5.232), IPMC_Control (P5.7)
IPMC_JMST_TDO: IPMC_UnderTesting (J5.109), IPMC_Control (P5.1)
IPMC_JMST_TMS: IPMC_UnderTesting (J5.110), IPMC_Control (P5.5)
IPMC_UART_RX: IPMC_UnderTesting (J5.60), UART (R11.2)
IPMC_UART_TX: IPMC_UnderTesting (J5.57), UART (R21.2)
MMC0_SCL: MMC_Interface (J4.14), IPMC_UnderTesting (J5.26), IPMC_Control (J7.148)
MMC0_SDA: MMC_Interface (J4.16), IPMC_UnderTesting (J5.27), IPMC_Control (J7.149)
MMC1_SCL: MMC_Interface (J3.14), IPMC_UnderTesting (J5.37), IPMC_Control (J7.159)
MMC1_SDA: MMC_Interface (J3.16), IPMC_UnderTesting (J5.38), IPMC_Control (J7.160)
MP_ENA_0: IPMC_UnderTesting (J5.28 P3.7), IPMC_Control (J7.150)
MP_ENA_1: IPMC_UnderTesting (J5.150), IPMC_Control (J7.28)
MP_ENA_2: IPMC_UnderTesting (J5.39 P2.7), IPMC_Control (J7.161)
MP_ENA_3: IPMC_UnderTesting (J5.161), IPMC_Control (J7.39)
MP_ENA_4: IPMC_UnderTesting (J5.50), IPMC_Control (J7.50)
MP_FLT_0: IPMC_UnderTesting (J5.32 P3.3), IPMC_Control (J7.154)
MP_FLT_1: IPMC_UnderTesting (J5.154), IPMC_Control (J7.32)
MP_FLT_2: IPMC_UnderTesting (J5.43 P2.3), IPMC_Control (J7.165)
MP_FLT_3: IPMC_UnderTesting (J5.165), IPMC_Control (J7.43)
MP_FLT_4: IPMC_UnderTesting (J5.54), IPMC_Control (J7.54)
MP_PG_0: IPMC_UnderTesting (J5.30 P3.5), IPMC_Control (J7.152)
MP_PG_1: IPMC_UnderTesting (J5.152), IPMC_Control (J7.30)
MP_PG_2: IPMC_UnderTesting (J5.41 P2.5), IPMC_Control (J7.163)
MP_PG_3: IPMC_UnderTesting (J5.163), IPMC_Control (J7.41)
MP_PG_4: IPMC_UnderTesting (J5.52), IPMC_Control (J7.52)
PWR_ENA_0: IPMC_UnderTesting (J5.29 P3.6), IPMC_Control (J7.151)
PWR_ENA_1: IPMC_UnderTesting (J5.151), IPMC_Control (J7.29)
PWR_ENA_2: IPMC_UnderTesting (J5.40 P2.6), IPMC_Control (J7.162)
PWR_ENA_3: IPMC_UnderTesting (J5.162), IPMC_Control (J7.40)
PWR_ENA_4: IPMC_UnderTesting (J5.51), IPMC_Control (J7.51)
PWR_FLT_0: IPMC_UnderTesting (J5.33 P3.2), IPMC_Control (J7.155)
PWR_FLT_1: IPMC_UnderTesting (J5.155), IPMC_Control (J7.33)
PWR_FLT_2: IPMC_UnderTesting (J5.44 P2.2), IPMC_Control (J7.166)
PWR_FLT_3: IPMC_UnderTesting (J5.166), IPMC_Control (J7.44)
PWR_FLT_4: IPMC_UnderTesting (J5.55), IPMC_Control (J7.55)
PWR_PG_0: IPMC_UnderTesting (J5.31 P3.4), IPMC_Control (J7.153)
PWR_PG_1: IPMC_UnderTesting (J5.153), IPMC_Control (J7.31)
PWR_PG_2: IPMC_UnderTesting (J5.42 P2.4), IPMC_Control (J7.164)
PWR_PG_3: IPMC_UnderTesting (J5.164), IPMC_Control (J7.42)
PWR_PG_4: IPMC_UnderTesting (J5.53), IPMC_Control (J7.53)